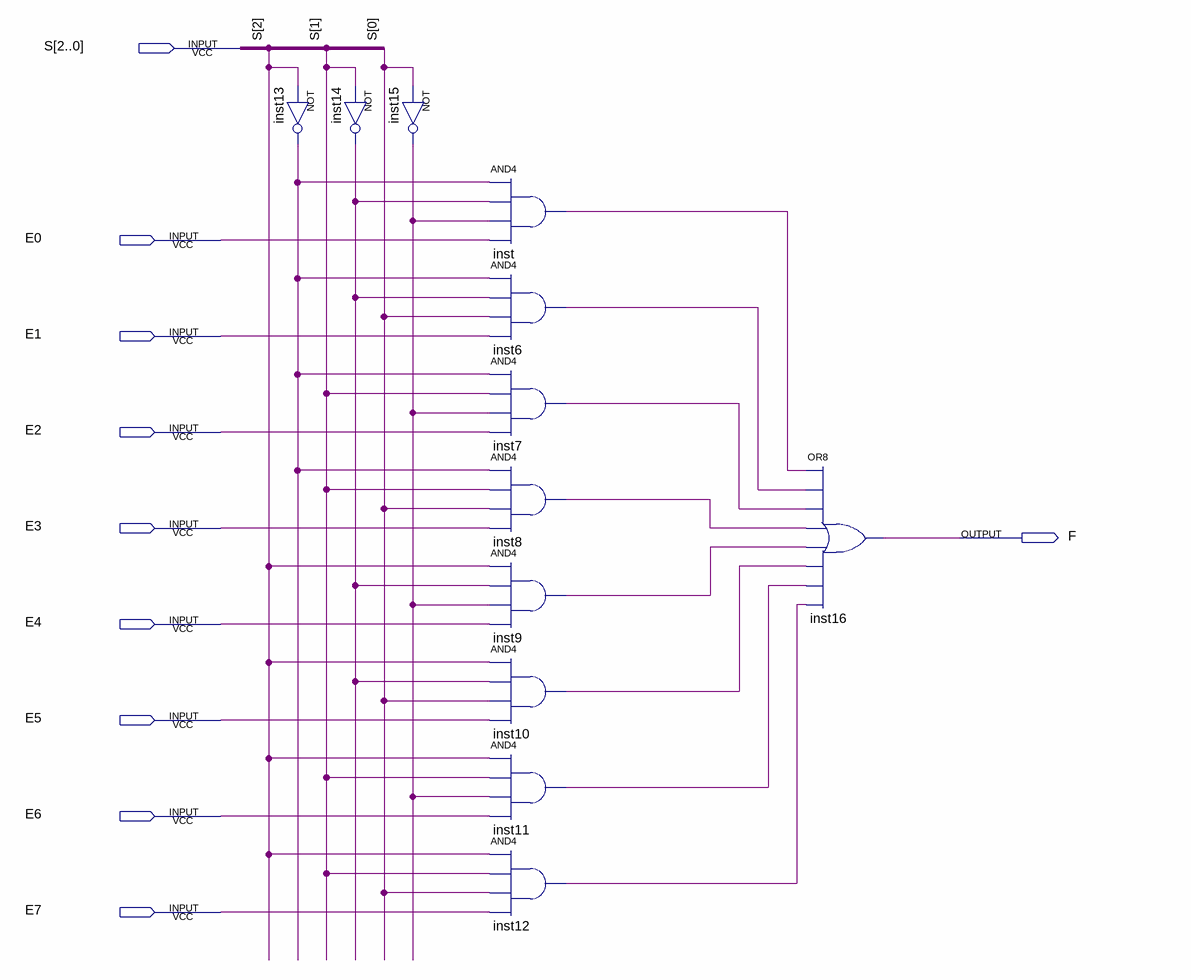
[diagram p0: schematic sheet]
// Quartus schematic mux_8x1_1bit.bdf as structural Verilog: 12 symbols, 10 pins
module mux_8x1_1bit (
  input  [2:0] S,
  input  E0,
  input  E1,
  input  E2,
  input  E3,
  input  E4,
  input  E5,
  input  E6,
  input  E7,
  output F
);

  wire inst6_out, inst7_out, inst8_out, inst9_out, inst10_out, inst11_out, inst12_out, inst13_out,
       inst14_out, inst15_out, inst_out;

  not inst13 (inst13_out, S[2]);
  not inst14 (inst14_out, S[1]);
  not inst15 (inst15_out, S[0]);
  and inst (inst_out, inst13_out, inst14_out, inst15_out, E0);
  and inst6 (inst6_out, inst13_out, inst14_out, S[0], E1);
  and inst7 (inst7_out, inst13_out, S[1], inst15_out, E2);
  and inst8 (inst8_out, inst13_out, S[1], S[0], E3);
  and inst9 (inst9_out, S[2], inst14_out, inst15_out, E4);
  and inst10 (inst10_out, S[2], inst14_out, S[0], E5);
  and inst11 (inst11_out, S[2], S[1], inst15_out, E6);
  and inst12 (inst12_out, S[2], S[1], S[0], E7);
  or inst16 (F, inst_out, inst6_out, inst7_out, inst8_out, inst9_out, inst10_out, inst11_out, inst12_out);
endmodule
